# Altium schematic sheet VGA.SchDoc
size A3; Organization: Protel International P/L; Address1: L3, 12a Rodborough Rd; Address2: Frenchs Forest; Address3: NSW; Address4: Australia 2086
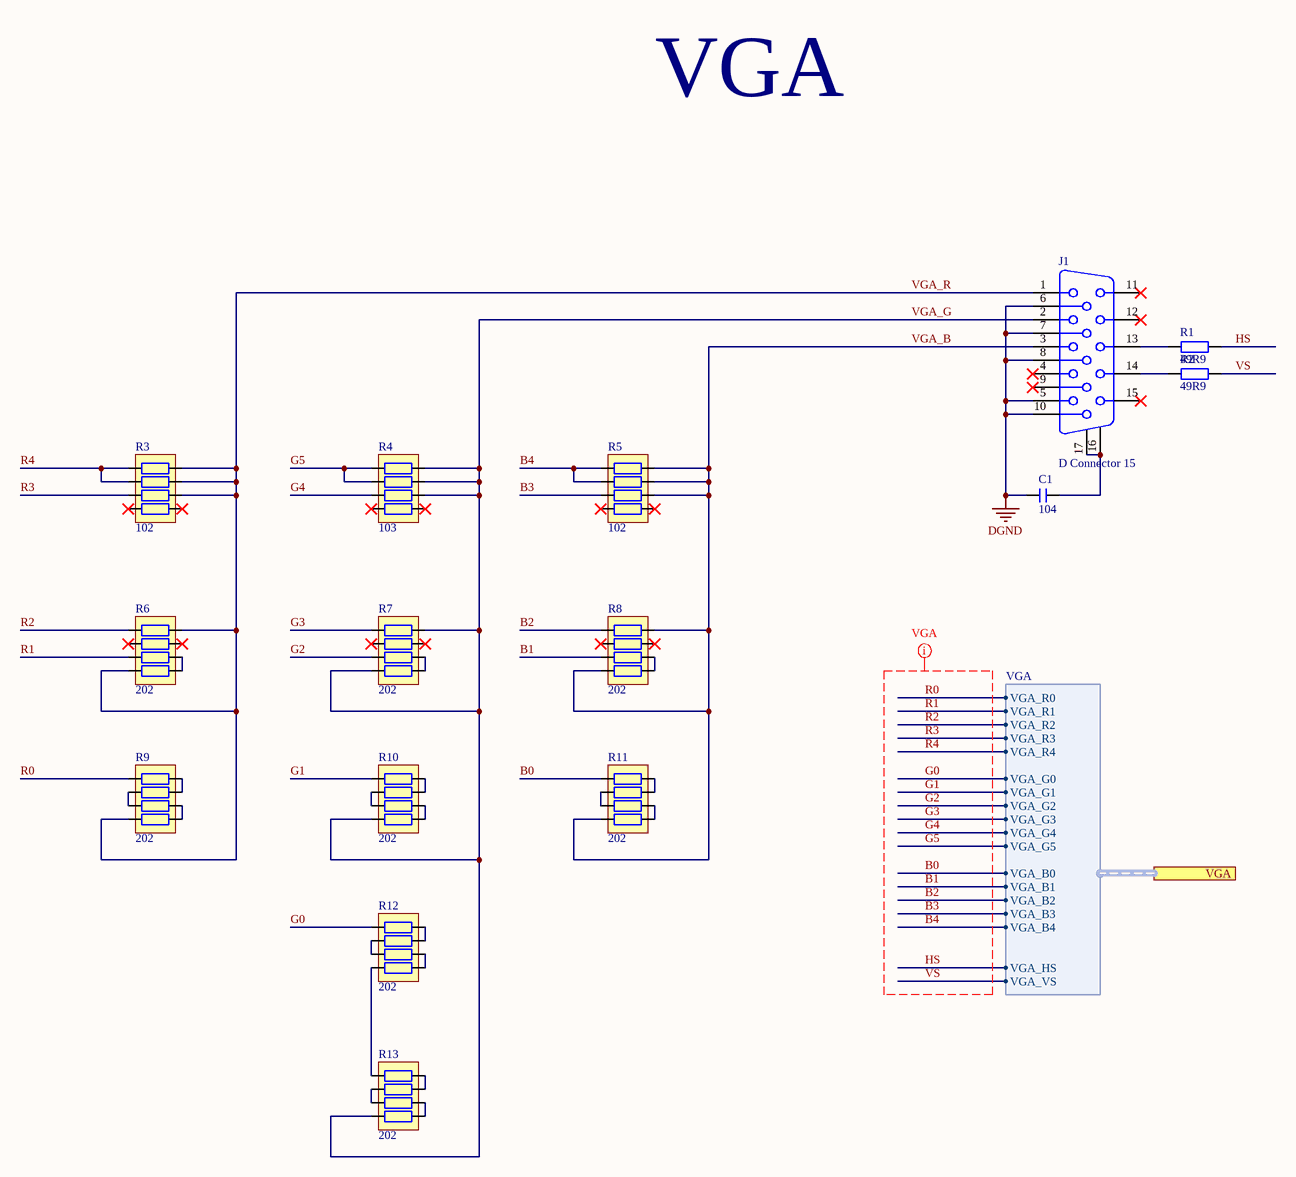
[diagram p0: VGA.SchDoc]

## Parts
C1  104  [C 0402_M]
J1  D Connector 15  [VGA15b]
R1  49R9  [R 0402_M]
R2  49R9  [R 0402_M]
R3  102  [RCA-8P4R-0402]
R4  103  [RCA-8P4R-0402]
R5  102  [RCA-8P4R-0402]
R6  202  [RCA-8P4R-0402]
R7  202  [RCA-8P4R-0402]
R8  202  [RCA-8P4R-0402]
R9  202  [RCA-8P4R-0402]
R10  202  [RCA-8P4R-0402]
R11  202  [RCA-8P4R-0402]
R12  202  [RCA-8P4R-0402]
R13  202  [RCA-8P4R-0402]

## Ports
VGA (harness VGA)

## Harnesses
VGA: VGA_R0, VGA_R1, VGA_R2, VGA_R3, VGA_R4, VGA_G0, VGA_G1, VGA_G2, VGA_G3, VGA_G4, VGA_G5, VGA_B0, VGA_B1, VGA_B2, VGA_B3, VGA_B4, VGA_HS, VGA_VS

## Nets
DGND: C1.1 J1.5 J1.6 J1.7 J1.8 J1.10
B0: R11.1 ; port VGA.VGA_B0
B1: R8.3 ; port VGA.VGA_B1
B2: R8.1 ; port VGA.VGA_B2
B3: R5.3 ; port VGA.VGA_B3
B4: R5.1 R5.2 ; port VGA.VGA_B4
G0: R12.1 ; port VGA.VGA_G0
G1: R10.1 ; port VGA.VGA_G1
G2: R7.3 ; port VGA.VGA_G2
G3: R7.1 ; port VGA.VGA_G3
G4: R4.3 ; port VGA.VGA_G4
G5: R4.1 R4.2 ; port VGA.VGA_G5
HS: R1.1 ; port VGA.VGA_HS
R0: R9.1 ; port VGA.VGA_R0
R1: R6.3 ; port VGA.VGA_R1
R2: R6.1 ; port VGA.VGA_R2
R3: R3.3 ; port VGA.VGA_R3
R4: R3.1 R3.2 ; port VGA.VGA_R4
VGA_B: J1.3 R5.6 R5.7 R5.8 R8.4 R8.8 R11.4
VGA_G: J1.2 R4.6 R4.7 R4.8 R7.4 R7.8 R10.4 R13.4
VGA_R: J1.1 R3.6 R3.7 R3.8 R6.4 R6.8 R9.4
VS: R2.1 ; port VGA.VGA_VS
NetC1_2: C1.2 J1.16(MH2) J1.17(MH1)
NetJ1_13: J1.13 R1.2
NetJ1_14: J1.14 R2.2
NetR6_5: R6.5 R6.6
NetR7_5: R7.5 R7.6
NetR8_5: R8.5 R8.6
NetR9_2: R9.2 R9.3
NetR9_5: R9.5 R9.6
NetR9_7: R9.7 R9.8
NetR10_2: R10.2 R10.3
NetR10_5: R10.5 R10.6
NetR10_7: R10.7 R10.8
NetR11_2: R11.2 R11.3
NetR11_5: R11.5 R11.6
NetR11_7: R11.7 R11.8
NetR12_2: R12.2 R12.3
NetR12_4: R12.4 R13.1
NetR12_5: R12.5 R12.6
NetR12_7: R12.7 R12.8
NetR13_2: R13.2 R13.3
NetR13_5: R13.5 R13.6
NetR13_7: R13.7 R13.8

Not connected (* = marked no-connect by the designer): J1 4* 9* 11* 12* 15*; R3 4* 5*; R4 4* 5*; R5 4* 5*; R6 2* 7*; R7 2* 7*; R8 2* 7*

## Layout directives
rule Matched Net Lengths [Tolerance = 100mil]; net class VGA: B0, B1, B2, B3, B4, G0, G1, G2, G3, G4, G5, HS, R0, R1, R2, R3, R4, VS

## Notes on the sheet
- VGA
- Title
- Size:
- Date:
- A3
- Number:
- Time:
- Revision:
- Sheet
- of
- File:

## Library data of the parts
C1 = C: 无极性贴片电容; 版权归属: 源创客; BOM名称: 无极性贴片电容; 学习资源: www.ooocke.com
J1 = D Connector 15: VGA通讯端口; 版权归属: 源创客; 学习资源: www.ooocke.com; BOM名称: VGA通讯端口
R1 R2 = R: 贴片电阻; 版权归属: 源创客; BOM名称: 贴片电阻; 学习资源: www.ooocke.com
R3-R13 = R-8P4R: 贴片网络排阻; 版权归属: 源创客; BOM名称: 贴片网络排阻; 学习资源: www.ooocke.com